# EasyEDA Pro project Complete_project.epro, schematic Schematic1

## Sheets
1 主控: Board Name: core; Create Date: 2024-10-04; Page Name: 主控; Project Name: 煮茶机; Schematic Name: Schematic1; Update Date: 2024-12-08; Company: 嘉立创EDA; Page Size: A4; Version: V1.0
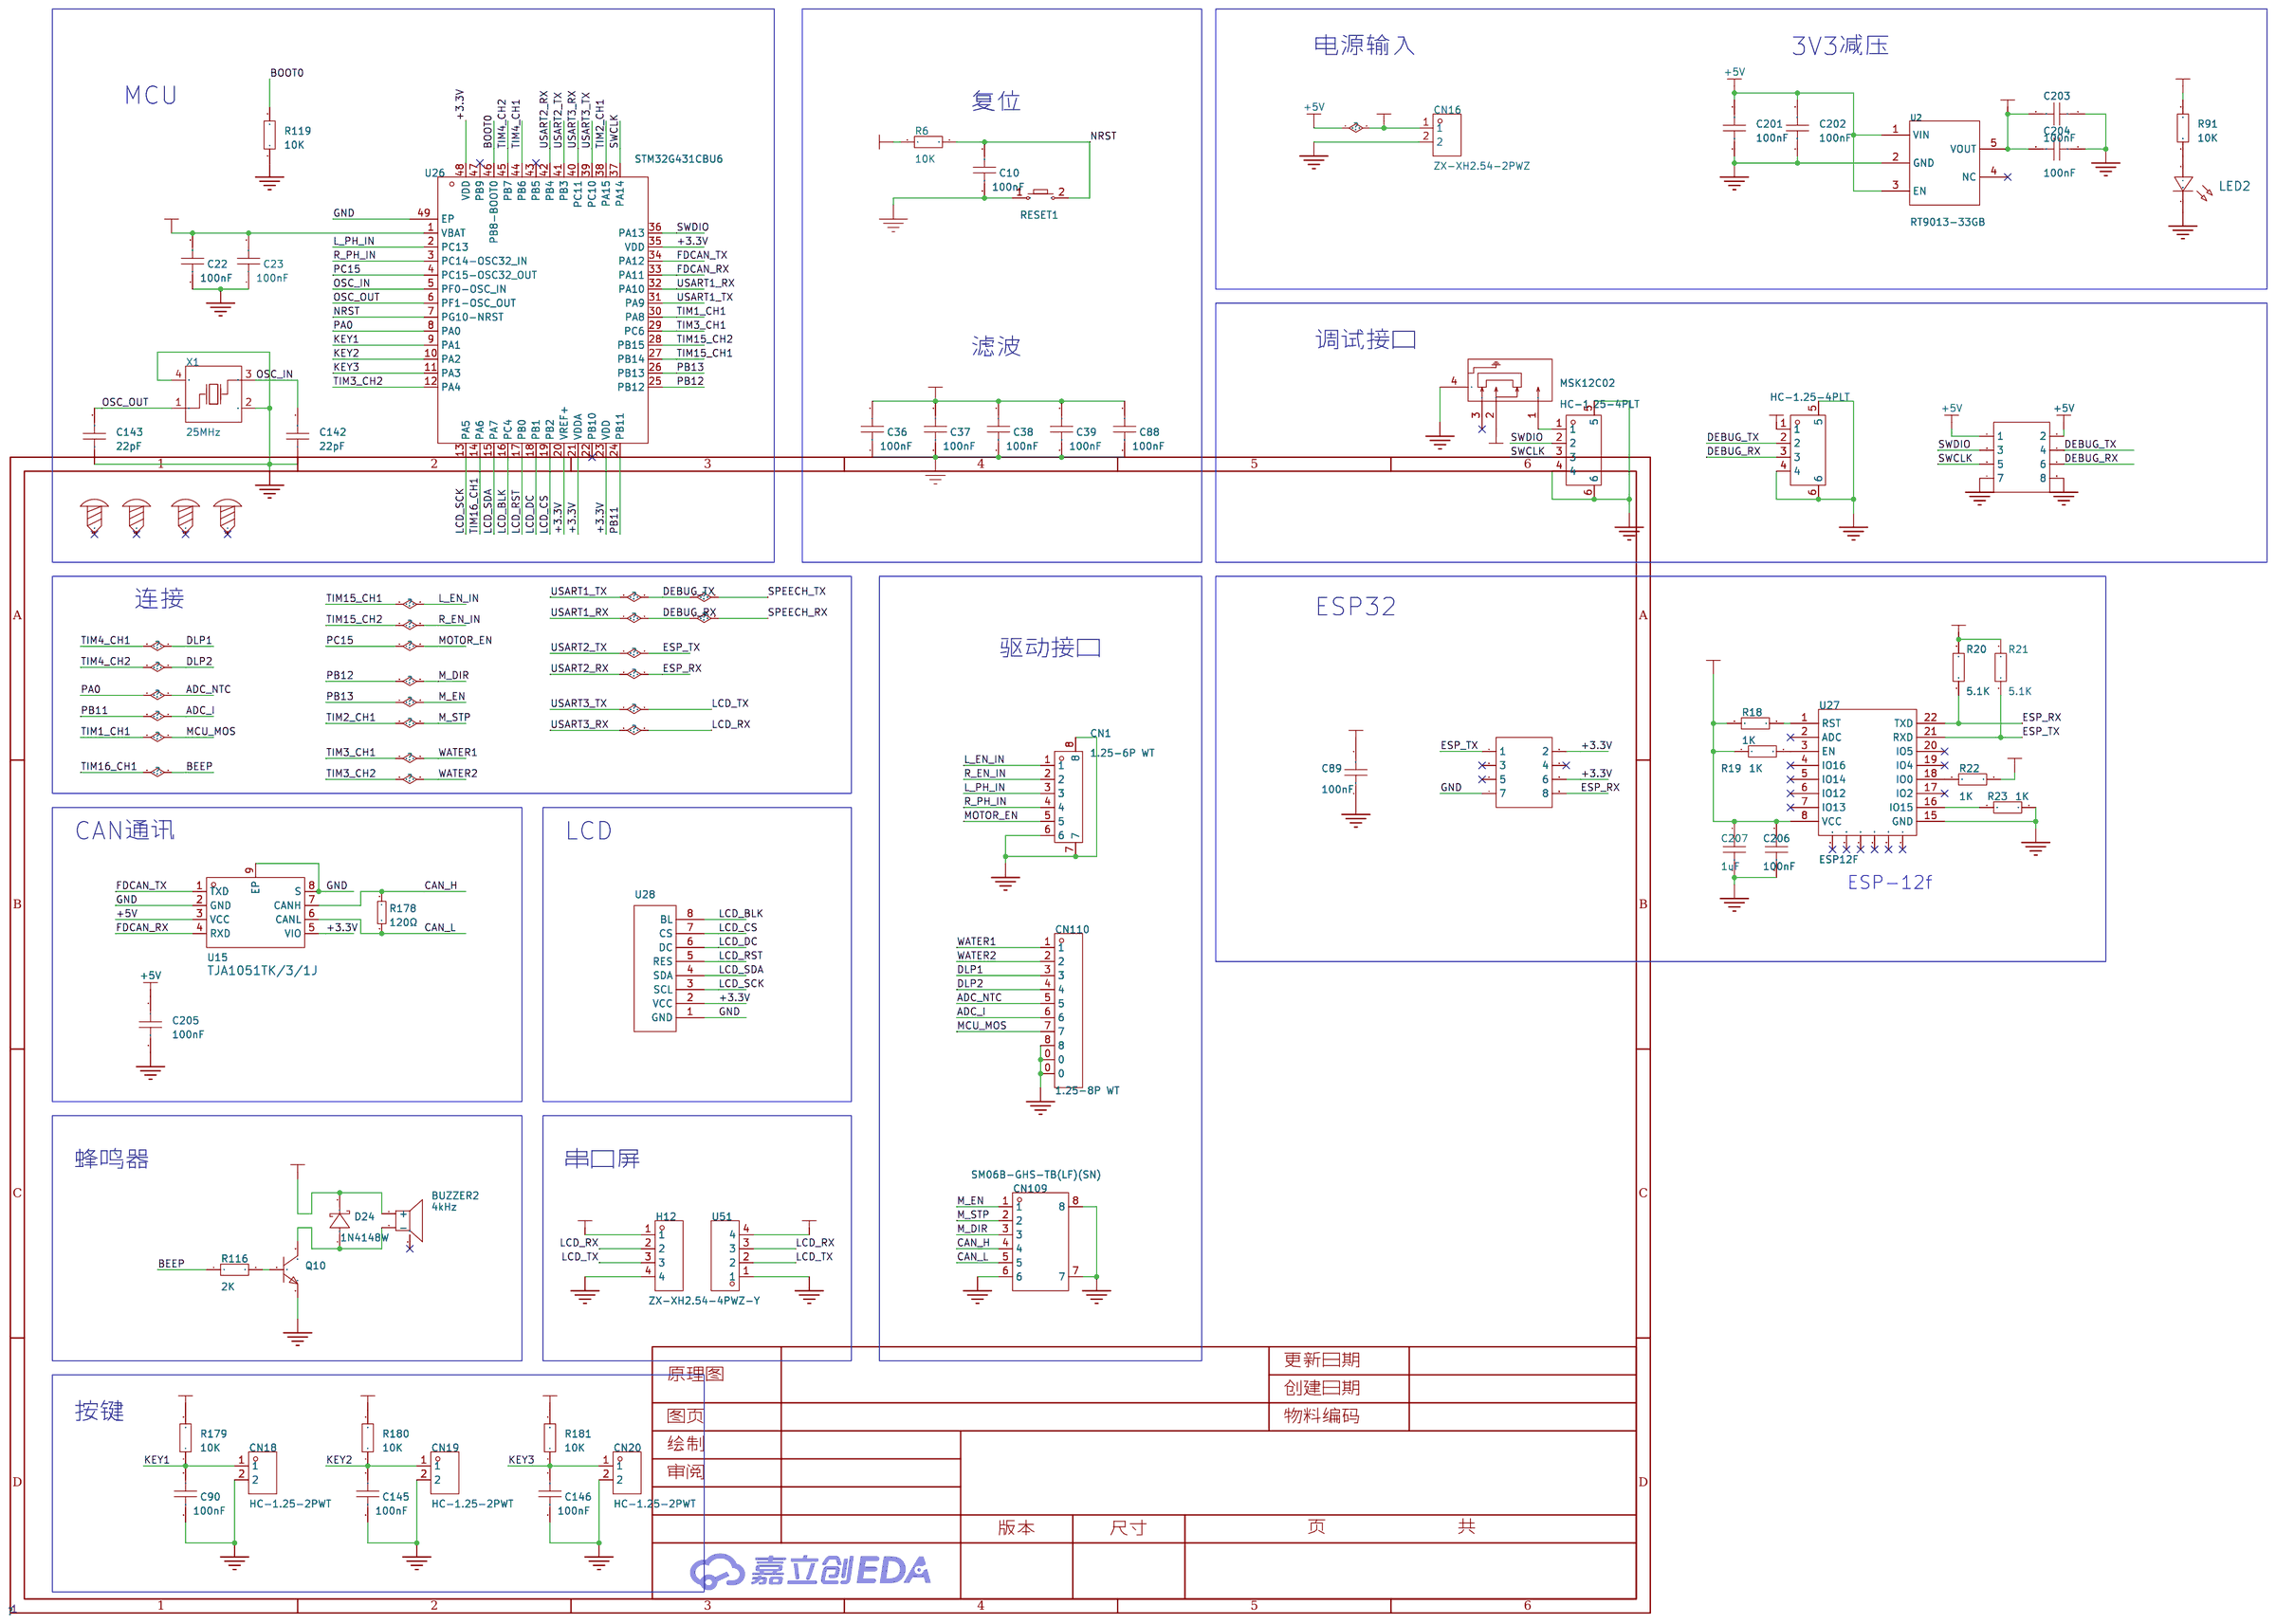
[diagram p0: 主控]
2 POWER TREE: Create Date: 2024-10-05; Page Name: POWER TREE; Update Date: 2024-12-05
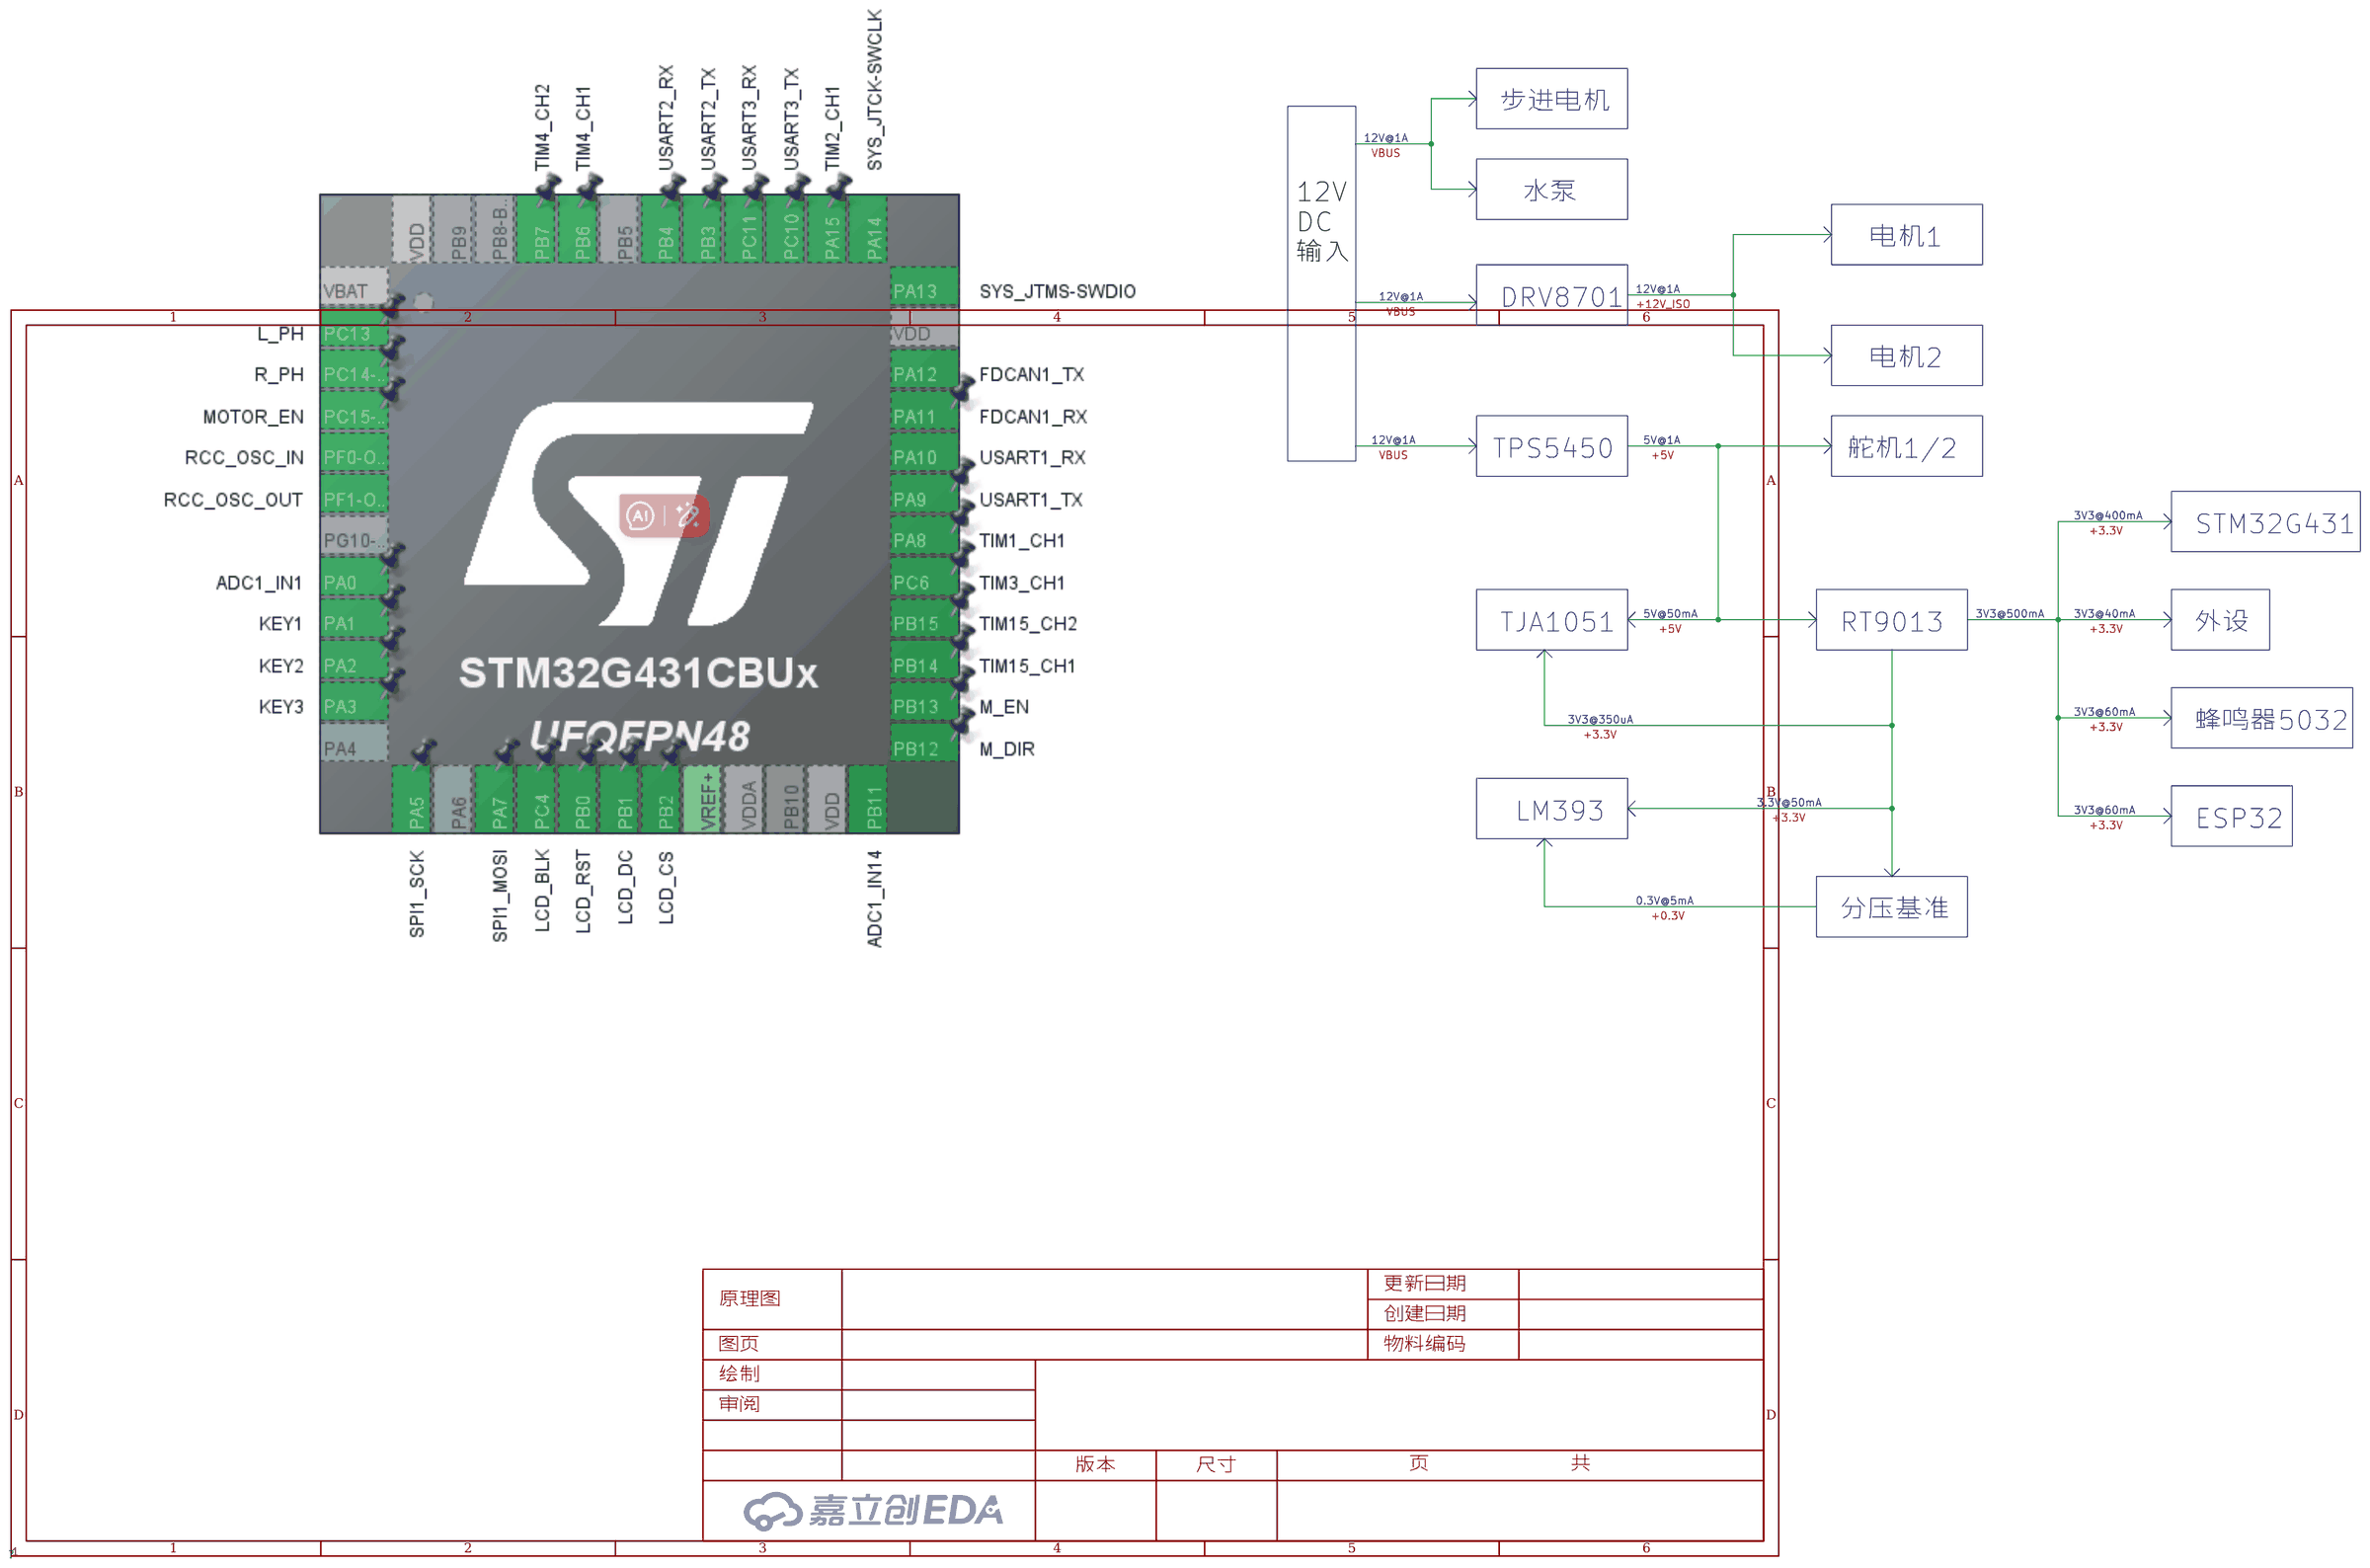
[diagram p1: POWER TREE]

## Parts
BUZZER2  4kHz  [BUZ-SMD_L5.0-W5.5-P4.60]
C10  100nF  [C0805]
C22  100nF  [C0805]
C23  100nF  [C0805]
C36  100nF  [C0805]
C37  100nF  [C0805]
C38  100nF  [C0805]
C39  100nF  [C0805]
C88  100nF  [C0805]
C89  100nF  [C0805]
C90  100nF  [C0805]
C142  22pF  [C0805]
C143  22pF  [C0805]
C145  100nF  [C0805]
C146  100nF  [C0805]
C201  100nF  [C0805]
C202  100nF  [C0805]
C203  100nF  [C0805]
C204  100nF  [C0805]
C205  100nF  [C0805]
C206  100nF  [C0805]
C207  1uF  [C0805]
CN1  1.25-6P WT  [CONN-SMD_1.25-6PWT]
CN12  HC-1.25-4PLT  [CONN-SMD_4P-P1.25_HCTL_HC-1.25-4PLT]
CN16  ZX-XH2.54-2PWZ  [CONN-TH_2P-P2.50_ZX-XH2.54-2PWZ]
CN17  HC-1.25-4PLT  [CONN-SMD_4P-P1.25_HCTL_HC-1.25-4PLT]
CN18  HC-1.25-2PWT  [CONN-SMD_2P-P1.25-HC-1.25-2PWT]
CN19  HC-1.25-2PWT  [CONN-SMD_2P-P1.25-HC-1.25-2PWT]
CN20  HC-1.25-2PWT  [CONN-SMD_2P-P1.25-HC-1.25-2PWT]
CN109  SM06B-GHS-TB(LF)(SN)  [CONN-TH_SM06B-GHS-TB-LF-SN]
CN110  1.25-8P WT  [CONN-SMD_8P-P1.25-L4.4-W14.8]
D24  1N4148W  [SOD-123_L2.7-W1.6-LS3.7-FD]
H4  -  [HDR-TH_8P-P2.54-V-F-R2-C4-S2.54-1]
H9  -  [HDR-TH_8P-P2.54-V-F-R2-C4-S2.54-1]
H12  -  [HDR-TH_4P-P2.54-V-M]
LED2  -  [LED_0805]
Q10  -  [S8050_SOT-23]
R6  10K  [R0805]
R18  1K  [R0805]
R19  1K  [R0805]
R20  5.1K  [R0805]
R21  5.1K  [R0805]
R22  1K  [R0805]
R23  1K  [R0805]
R91  10K  [R0805]
R116  2K  [R0805]
R119  10K  [R0805]
R178  120Ω  [R0805_S]
R179  10K  [R0805]
R180  10K  [R0805]
R181  10K  [R0805]
RESET1  -  [SW_PB2_A1]
SCREW1  -  [M3螺丝]
SCREW2  -  [M3螺丝]
SCREW3  -  [M3螺丝]
SCREW4  -  [M3螺丝]
SW5  MSK12C02  [SW-TH_MSK12C02]
U2  RT9013-33GB  [SOT-23-5_L3.0-W1.7-P0.95-LS2.8-BL]
U15  TJA1051TK/3/1J  [HVSON-8_L3.0-W3.0-P0.65-BL-EP]
U26  STM32G431CBU6  [UFQFPN-48_L7.0-W7.0-P0.50-BL-EP]
U27  ESP12F  [ESP12F]
U28  -  [1.8__TFT LCD]
U51  ZX-XH2.54-4PWZ-Y  [CONN-TH_4P-P2.50_ZX-XH2.54-4PWZ-Y]
X1  25MHz  [CRYSTAL-SMD_4P-L3.2-W2.5-BL]

## Library data of the parts
BUZZER2 = MLT-5020: 驱动方式:无源(外部驱动);构造类型:电磁式;频率:4kHz;; Supplier Part: C94598; Manufacturer: 华能; Supplier Footprint: SMD,5x5mm; JLCPCB Part Class: 扩展库; Datasheet: https://atta.szlcsc.com/upload/public/pdf/source/20210811/111454390007D221D7259018FB170E62.pdf; Supplier: LCSC; Oscillator Circuit: 无源(外部驱动); Technology Type: 电磁式; Length: 5.2mm; Width: 5.2mm; Height: 2.5mm
C10 C22 C23 C36-C39 C88-C90 C142 C143 C145 C146 C201-C207 = CAP_0805: Supplier Footprint: 0805
CN1 = 1.25-6P WT: 插针结构:1x6P;间距:1.25mm;安装方式:卧贴;参考系列:-;总PIN数:6P;排数:1;每排PIN数:6;行距:-;额定电流:1A;工作温度范围:-25℃~+85℃;; LCSC Part Name: 1x6P 间距:1.25mm 卧贴; Supplier Part: C668617; Manufacturer: SHOU HAN(首韩); Supplier Footprint: SMD,P=1.25mm,卧贴; JLCPCB Part Class: 扩展库; Datasheet: https://atta.szlcsc.com/upload/public/pdf/source/20200618/C668617_2618E8037EA4B5DDA2614CE7F66138E1.pdf; Supplier: LCSC; Pins Structure: 1x6P; Pitch: 1.25mm; Mounting Style: 卧贴; Number of Pins: 6P; Number of Rows: 1; Number of PINs Per Row: 6; Current Rating (Max): 1A; Operating Temperature Range: -25℃~+85℃
CN12 CN17 = HC-1.25-4PLT: 插针结构:1x4P;间距:1.25mm;安装方式:立贴;参考系列:-;总PIN数:4P;排数:1;每排PIN数:4;行距:-;额定电流:2A;触头材质:黄铜;触头镀层:锡;工作温度范围:-25℃~+85℃;; LCSC Part Name: 1x4P 间距:1.25mm 立贴; Supplier Part: C2845390; Manufacturer: HCTL(华灿天禄); Supplier Footprint: SMD,P=1.25mm; JLCPCB Part Class: 扩展库; Datasheet: https://atta.szlcsc.com/upload/public/pdf/source/20230707/8E5913B5A3195C18F5EE12EA4CB86B82.pdf; Supplier: LCSC; Pins Structure: 1x4P; Pitch: 1.25mm; Mounting Style: 立贴; Number of Pins: 4P; Number of Rows: 1; Number of PINs Per Row: 4; Current Rating (Max): 2A; Contact Material: 黄铜; Contact Plating: 锡; Operating Temperature Range: -25℃~+85℃
CN16 = ZX-XH2.54-2PWZ: 插针结构:1x2P;间距:2.54mm;安装方式:弯插;参考系列:XH;总PIN数:2P;排数:1;每排PIN数:2;行距:-;额定电流:3A;触头材质:黄铜;触头镀层:锡;工作温度范围:-25℃~+85℃;; Supplier Part: C7429641; Manufacturer: Megastar(兆星); Supplier Footprint: 弯插,P=2.54mm; JLCPCB Part Class: 扩展库; Datasheet: https://atta.szlcsc.com/upload/public/pdf/source/20230619/56AE8F2E01CDFEAA97FC89B5ED558AB5.pdf; Supplier: LCSC; Pins Structure: 1x2P; Pitch: 2.54mm; Mounting Style: 弯插; Reference Series: XH; Number of Pins: 2P; Number of Rows: 1; Number of PINs Per Row: 2; Current Rating (Max): 3A; Contact Material: 黄铜; Contact Plating: 锡; Operating Temperature Range: -25℃~+85℃
CN18-CN20 = HC-1.25-2PWT: 插针结构:1x2P;间距:1.25mm;安装方式:卧贴;参考系列:PicoBlade(MX 1.25);总PIN数:2P;排数:1;每排PIN数:2;行距:-;额定电流:1A;触头材质:黄铜;触头镀层:锡;工作温度范围:-40℃~+105℃;; LCSC Part Name: 1x2P 间距:1.25mm 卧贴 系列:PicoBlade(MX 1.25); Supplier Part: C2845379; Manufacturer: HCTL(华灿天禄); Supplier Footprint: SMD,P=1.25mm,卧贴; JLCPCB Part Class: Extended Part; Datasheet: https://atta.szlcsc.com/upload/public/pdf/source/20240930/9508A8292CCC87B0C29E3A028D56E30A.pdf; Supplier: LCSC; Pins Structure: 1x2P; Pitch: 1.25mm; Mounting Style: 卧贴; Reference Series: PicoBlade(MX 1.25); Number of Pins: 2P; Number of Rows: 1; Number of PINs Per Row: 2; Current Rating (Max): 1A; Contact Material: 黄铜; Contact Plating: 锡; Operating Temperature Range: -40℃~+105℃; Rated Voltage (Max): 125V; Plastic Material: LCP; Flame Retardant Rating: UL94V-0; Supplementary Features: 辅助焊脚; Z-Height of the Board: 3.57mm; X-Length of Bottom Edge on Board (Spacing Line): 7.55mm; Y-Width of Bottom Edge on Board: 5.25mm
CN109 = SM06B-GHS-TB(LF)(SN): 插针结构:1x6P;间距:1.25mm;安装方式:卧贴;参考系列:GH;总PIN数:6P;排数:1;每排PIN数:6;行距:-;额定电流:1A;触头材质:磷青铜;触头镀层:锡;工作温度范围:-25℃~+85℃;; LCSC Part Name: 1x6P 间距:1.25mm 卧贴 系列:GH; Supplier Part: C133065; Manufacturer: JST; Supplier Footprint: SMD,P=1.25mm,卧贴; JLCPCB Part Class: 扩展库; Datasheet: https://atta.szlcsc.com/upload/public/pdf/source/20180323/112205B2CF875947C9562BFC7B01FA26.pdf; Supplier: LCSC; Pins Structure: 1x6P; Pitch: 1.25mm; Mounting Style: 卧贴; Reference Series: GH; Number of Pins: 6P; Number of Rows: 1; Number of PINs Per Row: 6; Current Rating (Max): 1A; Contact Material: 磷青铜; Contact Plating: 锡; Operating Temperature Range: -25℃~+85℃; Rated Voltage (Max): 50V; Plastic Material: PA9T; Flame Retardant Rating: UL94V-0; Supplementary Features: 辅助焊脚; Colour: 白色; Z-Height of the Board: 4.25mm; X-Length of Bottom Edge on Board (Spacing Line): 10.75mm; Y-Width of Bottom Edge on Board: 4.13mm
CN110 = 1.25-8P WT: 插针结构:1x8P;间距:1.25mm;安装方式:卧贴;参考系列:-;总PIN数:8P;排数:1;每排PIN数:8;行距:-;额定电流:-;工作温度范围:-40℃~+85℃;; Supplier Part: C2681529; Manufacturer: SHOU HAN(首韩); Supplier Footprint: SMD,P=1.25mm,卧贴; JLCPCB Part Class: 扩展库; Datasheet: https://atta.szlcsc.com/upload/public/pdf/source/20210107/C2681529_22D70B53821B9BA4D70344DBAB526F9C.pdf; Supplier: LCSC; Pins Structure: 1x8P; Pitch: 1.25mm; Mounting Style: 卧贴; Number of Pins: 8P; Number of Rows: 1; Number of PINs Per Row: 8; Operating Temperature Range: -40℃~+85℃
D24 = 1N4148W_C7420318: 二极管配置:独立式;正向压降(Vf):1.25V@150mA;直流反向耐压(Vr):100V;平均整流电流(Io):150mA;功率:400mW;反向恢复时间(trr):4ns;; LCSC Part Name: 电压:100V 电流:150mA; Supplier Part: C7420318; Manufacturer: 宏迦橙; Supplier Footprint: SOD-123; JLCPCB Part Class: 扩展库; Datasheet: https://atta.szlcsc.com/upload/public/pdf/source/20230828/E5C3F7A4272052930A7E03B75759BF50.pdf; Supplier: LCSC; Diode Configuration: 独立式; Forward Voltage (Vf@If): 1.25V@150mA; Reverse Voltage (Vr): 100V; Average Rectified Current (Io): 150mA; Power Dissipation: 400mW; Reverse Leakage Current: 1uA@75V; Reverse Recovery Time (trr): 4ns; Operating Temperature: -55℃~+150℃
H4 H9 = HDR-F_2.54_2x4: Supplier Part: C92271; Supplier Footprint: 插件
H12 = HDR-M_2.54_1x4P: Supplier Part: C492403; Supplier Footprint: 插件
LED2 = LED_0805-R: Supplier Footprint: 0805
Q10 = S8050_SOT_NPN: Supplier Footprint: SOT-23
R6 R91 R116 R119 R179-R181 = Res_0805: Supplier Footprint: 0805
R18-R23 = Res_0603: Supplier Footprint: 0603
R178 = 0603WAF1200T5E: 阻值:120Ω;精度:±1%;功率:100mW;温度系数:±100ppm/℃;电阻类型:厚膜电阻;; LCSC Part Name: 120Ω ±1% 100mW 厚膜电阻; Supplier Part: C22787; Manufacturer: UNI-ROYAL(厚声); Supplier Footprint: 0603; JLCPCB Part Class: Basic Part; Datasheet: https://atta.szlcsc.com/upload/public/pdf/source/20200306/C422600_1E6D84923E4A46A82E41ADD87F860B5C.pdf; Supplier: LCSC; Tolerance: ±1%; Power(Watts): 100mW; Overload Voltage (Max): 75V; Temperature Coefficient: ±100ppm/℃; Type: 厚膜电阻; Operating Temperature Range: -55℃~+155℃; Pin Type: IN; Check: true
RESET1 = Key_SMD_3x4x2: Supplier Footprint: SMD
SCREW1-SCREW4 = M3螺丝: Supplier Footprint: 插件
SW5 = MSK12C02: 电路结构:单刀双掷;安装方式:卧贴;开关颜色:-;额定电流(DC):50mA;额定电压(DC):12V;额定电流(AC):-;额定电压(AC):-;机械寿命:1万次;; LCSC Part Name: 两档侧拨贴片 7脚 滑动开关; Supplier Part: C431540; Manufacturer: SHOU HAN(首韩); Supplier Footprint: SMD; JLCPCB Part Class: Extended Part; Datasheet: https://atta.szlcsc.com/upload/public/pdf/source/20190925/C431540_89155AEF0758B9AD1B2D805F83FB12E3.pdf; Supplier: LCSC; Circuit: 单刀双掷; Pin Style: SMD接片; Switch Length: 8mm; Switch Width: 2.8mm; Switch Height: 1.4mm; Mounting Style: 卧贴; Current Rating (DC): 50mA; Voltage Rating (DC): 12V; Mechanical Life: 1万次; Operating Temperature: -20℃~+70℃
U2 = RT9013-33GB: 输出类型:固定;输出极性:正;最大输入电压:5.5V;输出电压:3.3V;输出电流:500mA;电源纹波抑制比(PSRR):50dB@(10kHz);; LCSC Part Name: 输入5.5V 输出3.3V 500mA; Supplier Part: C47773; Manufacturer: RICHTEK(立锜); Supplier Footprint: SOT-23-5; JLCPCB Part Class: 扩展库; Datasheet: https://atta.szlcsc.com/upload/public/pdf/source/20150504/1457707282459.pdf; Supplier: LCSC; Output Type: 固定; Output Polarity: 正; Number of Outputs: 1; Maximum Input Voltage: 5.5V; Output Voltage: 3.3V; Dropout Voltage: 400mV@(500mA); Quiescent Current (Ground Current): 50uA; Output Current: 500mA; Power Supply Rejection Ratio (PSRR): 50dB@(10kHz); Operating Temperature: -40℃~+85℃
U15 = TJA1051TK/3/1J: Supplier Part: C2875699; Manufacturer: NXP(恩智浦); Supplier Footprint: VDFN-8; JLCPCB Part Class: ExtendedPart; Datasheet: https://atta.szlcsc.com/upload/public/pdf/source/20210128/C2671135_A82E49CDEFC20634F2534E8F261E286A.pdf; Supplier: LCSC; Check: true
U26 = STM32G431CBU6: CPU内核:ARM-M系列;程序存储容量:128KB;RAM总容量:32KB;GPIO端口数量:42;工作电压范围:1.71V~3.6V;CPU最大主频:170MHz;程序存储器类型:FLASH;; Supplier Part: C529356; Manufacturer: ST(意法半导体); Supplier Footprint: UFQFPN-48(7x7); JLCPCB Part Class: 扩展库; Datasheet: https://atta.szlcsc.com/upload/public/pdf/source/20200511/C529354_7C66CF00837B904D0C15DCE45B69418C.pdf; Supplier: LCSC; CPU Core: ARM-M系列; Program Storage Size: 128KB; RAM Size: 32KB; GPIO Ports Number: 42; Operating Voltage Range: 1.71V~3.6V; CPU Maximum Speed: 170MHz; Program Memory Type: FLASH; Operating Temperature Range: -40℃~+85℃; ADC (Bit): 12bit; DAC (Bit): 12bit; Peripheral/Function: DMA；PWM; Watchdog: 有; Infrared Data Association: 有; Low-Voltage Detect: 有; Direct Memory Access: 有; Internal Oscillator: 有
U27 = ESP12F: _: 3
U28 = 1.8寸TFT
U51 = ZX-XH2.54-4PWZ-Y: 插针结构:1x4P;间距:2.54mm;安装方式:弯插;参考系列:XH;总PIN数:4P;排数:1;每排PIN数:4;触头材质:铜合金;触头镀层:锡;工作温度范围:-25℃~+85℃;; LCSC Part Name: 1x4P 间距:2.54mm 弯插 系列:XH; Supplier Part: C22388631; Manufacturer: Megastar(兆星); Supplier Footprint: 弯插,P=2.54mm; JLCPCB Part Class: 扩展库; Datasheet: https://atta.szlcsc.com/upload/public/pdf/source/20240429/5637F708FFDFB25A638AA785AB789433.pdf; Supplier: LCSC; Pins Structure: 1x4P; Pitch: 2.54mm; Mounting Style: 弯插; Reference Series: XH; Number of Pins: 4P; Number of Rows: 1; Number of PINs Per Row: 4; Contact Material: 铜合金; Contact Plating: 锡; Operating Temperature Range: -25℃~+85℃; Rated Voltage (Max): 250V; Plastic Material: PA66; Colour: 黄色
X1 = X322525MOB4SI: 晶振类型:贴片晶振;频率:25MHz;常温频差:±10ppm;负载电容:12pF;频率稳定度(全温):±20ppm;; LCSC Part Name: 25MHz ±10ppm 12pF; Supplier Part: C9006; Manufacturer: YXC(扬兴晶振); Supplier Footprint: SMD3225-4P; JLCPCB Part Class: Basic Part; Datasheet: https://atta.szlcsc.com/upload/public/pdf/source/20240329/19D5F850207469550BEB00D7DFEDBC7A.pdf; Supplier: LCSC; Crystal Type: 贴片晶振; Normal temperature Frequency Tolerance: ±10ppm; Load Capacitor: 12pF; Frequency Stability(Full temperature range): ±20ppm; Operating Temperature: -40℃~+85℃

## Nets
+3.3V: BUZZER2.1(+) C22.2 C23.2 C36.2 C37.2 C38.2 C39.2 C88.2 C89.2 C203.2 C204.2 C206.2 C207.2 CN17.1 D24.2(K) H9.2 H9.6 R6.2 R18.1 R19.1 R20.2 R21.2 R22.2 R91.2 R179.2 R180.2 R181.2 SW5.2 U2.5(VOUT) U15.5(VIO) U26.1(VBAT) U26.20(VREF+) U26.21(VDDA) U26.23(VDD) U26.35(VDD) U26.48(VDD) U27.8(VCC) U28.2(VCC)
+5V: C201.2 C202.2 C205.2 CN16.1 H4.1 H4.2 H12.1 U2.1(VIN) U2.3(EN) U15.3(VCC) U51.4
GND: C10.2 C22.1 C23.1 C36.1 C37.1 C38.1 C39.1 C88.1 C89.1 C90.2 C142.1 C143.1 C145.2 C146.2 C201.1 C202.1 C203.1 C204.1 C205.1 C206.1 C207.1 CN1.6 CN1.7 CN1.8 CN12.4 CN12.5 CN12.6 CN16.2 CN17.4 CN17.5 CN17.6 CN18.2 CN19.2 CN20.2 CN109.6 CN109.7 CN109.8 CN110.0 CN110.8 H4.7 H4.8 H9.7 H12.4 LED2.1(C) Q10.2 R23.2 R119.1 RESET1.1 SW5.4 U2.2(GND) U15.2(GND) U15.8(S) U15.9(EP) U26.49(EP) U27.15(GND) U28.1(GND) U51.1 X1.2(GND) X1.4(GND)
ADC_I: CN110.6 U26.24(PB11)
ADC_NTC: CN110.5 U26.8(PA0)
BEEP: R116.1 U26.14(PA6)
BOOT0: R119.2 U26.46(PB8-BOOT0)
CAN_H: CN109.4 R178.1 U15.7(CANH)
CAN_L: CN109.5 R178.2 U15.6(CANL)
DEBUG_RX: CN17.3 H4.6 U26.32(PA10)
DEBUG_TX: CN17.2 H4.4 U26.31(PA9)
DLP1: CN110.3 U26.44(PB6)
DLP2: CN110.4 U26.45(PB7)
ESP_RX: H9.8 R20.1 U26.42(PB4) U27.22(TXD)
ESP_TX: H9.1 R21.1 U26.41(PB3) U27.21(RXD)
FDCAN_RX: U15.4(RXD) U26.33(PA11)
FDCAN_TX: U15.1(TXD) U26.34(PA12)
KEY1: C90.1 CN18.1 R179.1 U26.9(PA1)
KEY2: C145.1 CN19.1 R180.1 U26.10(PA2)
KEY3: C146.1 CN20.1 R181.1 U26.11(PA3)
L_EN_IN: CN1.1 U26.27(PB14)
L_PH_IN: CN1.3 U26.2(PC13)
LCD_BLK: U26.16(PC4) U28.8(BL)
LCD_CS: U26.19(PB2) U28.7(CS)
LCD_DC: U26.18(PB1) U28.6(DC)
LCD_RST: U26.17(PB0) U28.5(RES)
LCD_RX: H12.2 U26.40(PC11) U51.3
LCD_SCK: U26.13(PA5) U28.3(SCL)
LCD_SDA: U26.15(PA7) U28.4(SDA)
LCD_TX: H12.3 U26.39(PC10) U51.2
M_DIR: CN109.3 U26.25(PB12)
M_EN: CN109.1 U26.26(PB13)
M_STP: CN109.2 U26.38(PA15)
MCU_MOS: CN110.7 U26.30(PA8)
MOTOR_EN: CN1.5 U26.4(PC15-OSC32_OUT)
NRST: C10.1 R6.1 RESET1.2 U26.7(PG10-NRST)
OSC_IN: C142.2 U26.5(PF0-OSC_IN) X1.3(OSC2)
OSC_OUT: C143.2 U26.6(PF1-OSC_OUT) X1.1(OSC1)
R_EN_IN: CN1.2 U26.28(PB15)
R_PH_IN: CN1.4 U26.3(PC14-OSC32_IN)
SWCLK: CN12.3 H4.5 U26.37(PA14)
SWDIO: CN12.2 H4.3 U26.36(PA13)
TIM3_CH1: CN110.1 U26.29(PC6)
TIM3_CH2: CN110.2 U26.12(PA4)
$1N5298: BUZZER2.2(-) D24.1(A) Q10.3
$1N5299: Q10.1 R116.2
$1N5859: CN12.1 SW5.1
$1N23213: R19.2 U27.3(EN)
$1N23214: R18.2 U27.1(RST)
$1N23215: R22.1 U27.18(IO0)
$1N23223: R23.1 U27.16(IO15)
Net-(LED2-2): LED2.2(A) R91.1

Not connected (* = marked no-connect by the designer): BUZZER2 3(NC)*; H9 3* 4* 5*; SCREW1 1*; SCREW2 1*; SCREW3 1*; SCREW4 1*; SW5 3*; U2 4(NC)*; U26 22(PB10)* 43(PB5)* 47(PB9)*; U27 2(ADC)* 4(IO16)* 5(IO14)* 6(IO12)* 7(IO13)* 9* 10* 11* 12* 13* 14* 17(IO2)* 19(IO4)* 20(IO5)*

## Notes on the sheets
sheet 1
- 电源输入
- 3V3减压
- MCU
- 复位
- 滤波
- 调试接口
- 连接
- ESP32
- 驱动接口
- CAN通讯
- LCD
- ESP-12f
- 蜂鸣器
- 串口屏
- 按键
sheet 2
- 步进电机
- 12V@1A
- VBUS
- 水泵
- 电机1
- 12V
  DC
  输入
- 12V@1A
- 12V@1A
- VBUS
- DRV8701
- +12V_ISO
- 电机2
- 12V@1A
- 5V@1A
- VBUS
- TPS5450
- +5V
- 舵机1/2
- 3V3@400mA
- +3.3V
- STM32G431
- 5V@50mA
- 3V3@500mA
- 3V3@40mA
- TJA1051
- +5V
- RT9013
- +3.3V
- 外设
- 3V3@350uA
- 3V3@60mA
- +3.3V
- +3.3V
- 蜂鸣器5032
- 3.3V@50mA
- 3V3@60mA
- LM393
- +3.3V
- +3.3V
- ESP32
- 0.3V@5mA
- +0.3V
- 分压基准
